# EAGLE design project_02 (EAGLE 9.6.2)
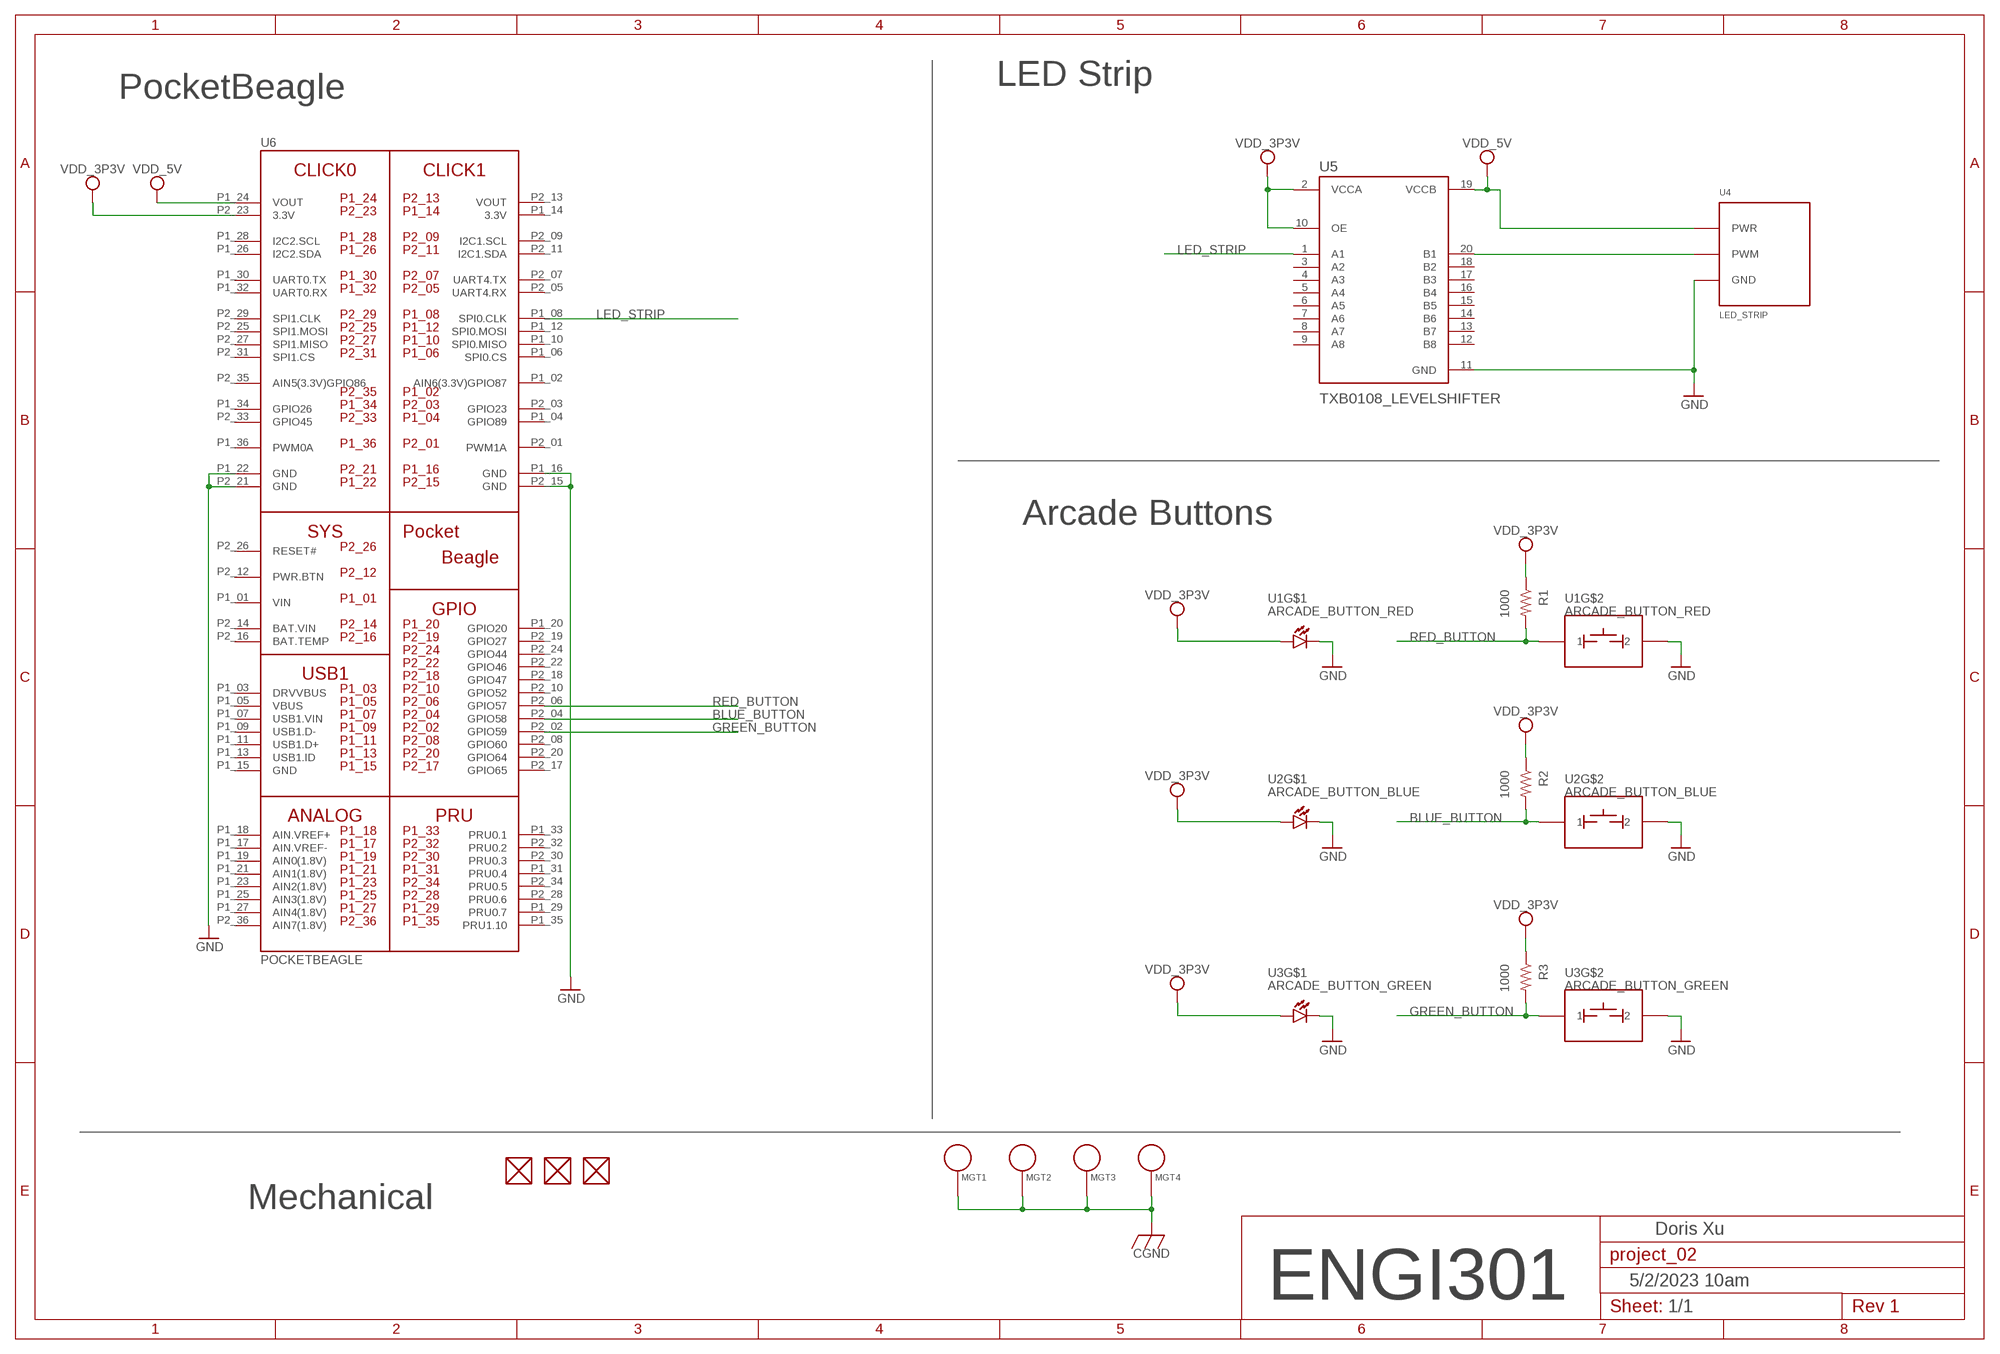
[diagram p0: schematic, sheet 1]

## Parts
FUD1  FIDUCIAL  [FIDUCIAL_40MIL]
FUD2  FIDUCIAL  [FIDUCIAL_40MIL]
FUD3  FIDUCIAL  [FIDUCIAL_40MIL]
MGT1  MOUNTING_HOLE  [MOUNTING_HOLE]
MGT2  MOUNTING_HOLE  [MOUNTING_HOLE]
MGT3  MOUNTING_HOLE  [MOUNTING_HOLE]
MGT4  MOUNTING_HOLE  [MOUNTING_HOLE]
R1  1000  R_R1206  [R1206]
R2  1000  R_R1206  [R1206]
R3  1000  R_R1206  [R1206]
U1  ARCADE_BUTTON_RED  ARCADE_BUTTON  [LED_BUTTON]
U2  ARCADE_BUTTON_BLUE  ARCADE_BUTTON  [LED_BUTTON]
U3  ARCADE_BUTTON_GREEN  ARCADE_BUTTON  [LED_BUTTON]
U4  LED_STRIP  [LED_STRIP]
U5  TXB0108_LEVELSHIFTER  [SOP65P640X120-20N]
U6  POCKETBEAGLE  [POCKETBEAGLE]

## Nets
BLUE_BUTTON: R2.2 U2.BUTTON_1 U6.P2_04(GPIO58)
CGND: MGT1.P$1 MGT2.P$1 MGT3.P$1 MGT4.P$1
GND: U1.BUTTON_2 U1.CATHODE U2.BUTTON_2 U2.CATHODE U3.BUTTON_2 U3.CATHODE U4.GND U5.11(GND) U6.P1_16(GND) U6.P1_22(GND) U6.P2_15(GND) U6.P2_21(GND)
GREEN_BUTTON: R3.2 U3.BUTTON_1 U6.P2_02(GPIO59)
LED_SIGNAL: U4.SIG(PWM) U5.20(B1)
LED_STRIP: U5.1(A1) U6.P1_08(SPI0.CLK)
RED_BUTTON: R1.2 U1.BUTTON_1 U6.P2_06(GPIO57)
VDD_3P3V: R1.1 R2.1 R3.1 U1.ANODE U2.ANODE U3.ANODE U5.2(VCCA) U5.10(OE) U6.P2_23(3.3V)
VDD_5V: U4.PWR U5.19(VCCB) U6.P1_24(VOUT)
Unconnected: FUD1.P$1 FUD2.P$1 FUD3.P$1 U5.3(A2) U5.4(A3) U5.5(A4) U5.6(A5) U5.7(A6) U5.8(A7) U5.9(A8) U5.12(B8) U5.13(B7) U5.14(B6) U5.15(B5) U5.16(B4) U5.17(B3) U5.18(B2) U6.P1_02(AIN6(3.3V)GPIO87) U6.P1_03(DRVVBUS) U6.P1_04(GPIO89) U6.P1_05(VBUS) U6.P1_06(SPI0.CS) U6.P1_07(USB1.VIN) U6.P1_09(USB1.D-) U6.P1_10(SPI0.MISO) U6.P1_11(USB1.D+) U6.P1_12(SPI0.MOSI) U6.P1_13(USB1.ID) U6.P1_15(GND) U6.P1_17(AIN.VREF-) U6.P1_18(AIN.VREF+) U6.P1_19(AIN0(1.8V)) U6.P1_20(GPIO20) U6.P1_21(AIN1(1.8V)) U6.P1_23(AIN2(1.8V)) U6.P1_25(AIN3(1.8V)) U6.P1_26(I2C2.SDA) U6.P1_27(AIN4(1.8V)) U6.P1_28(I2C2.SCL) U6.P1_29(PRU0.7) U6.P1_30(UART0.TX) U6.P1_31(PRU0.4) U6.P1_32(UART0.RX) U6.P1_33(PRU0.1) U6.P1_34(GPIO26) U6.P1_35(PRU1.10) U6.P1_36(PWM0A) U6.P2_01(PWM1A) U6.P2_03(GPIO23) U6.P2_05(UART4.RX) U6.P2_07(UART4.TX) U6.P2_08(GPIO60) U6.P2_09(I2C1.SCL) U6.P2_10(GPIO52) U6.P2_11(I2C1.SDA) U6.P2_12(PWR.BTN) U6.P2_16(BAT.TEMP) U6.P2_17(GPIO65) U6.P2_18(GPIO47) U6.P2_19(GPIO27) U6.P2_20(GPIO64) U6.P2_22(GPIO46) U6.P2_24(GPIO44) U6.P2_25(SPI1.MOSI) U6.P2_26(RESET#) U6.P2_27(SPI1.MISO) U6.P2_28(PRU0.6) U6.P2_29(SPI1.CLK) U6.P2_30(PRU0.3) U6.P2_31(SPI1.CS) U6.P2_32(PRU0.2) U6.P2_33(GPIO45) U6.P2_34(PRU0.5) U6.P2_35(AIN5(3.3V)GPIO86) U6.P2_36(AIN7(1.8V))

## Notes on the sheet
- LED Strip
- PocketBeagle
- Arcade Buttons
- Mechanical
- Doris Xu
- 5/2/2023 10am
- ENGI301
- 1/1

## Power pins joined to a net without a drawn wire
3.3V: U6.P1_14(3.3V)
BAT.VIN: U6.P2_14(BAT.VIN)
VIN: U6.P1_01(VIN)
VOUT: U6.P2_13(VOUT)

## Library data of the parts
FUD1-FUD3 = project_02:FIDUCIAL
MGT1-MGT4 = project_02:MOUNTING_HOLE: Chassis Mounting Hole w/GND connection ability
R1-R3 = project_02:R_: RESISTOR, American symbol
U1-U3 = project_02:ARCADE_BUTTON
U4 = project_02:LED_STRIP
U5 = project_02:TXB0108_LEVELSHIFTER: 8-Bit Bidirectional Voltage-Level Shifter with Auto Direction Sensing and +/-15-kV ESD Protect 20-TSSOP -40 to 85 Check availability <https://pricing.snapeda.com/parts/TXB0108PWRG4/Texas%20Instruments/view-part?ref=eda>; AVAILABILITY: In Stock; DESCRIPTION: 8-Bit Bidirectional Voltage-Level Shifter with Auto Direction Sensing and +/-15-kV ESD Protect 20-TSSOP -40 to 85; MF: Texas Instruments; MP: TXB0108PWRG4; PACKAGE: TSSOP-20 Texas Instruments; PRICE: None; PURCHASE-URL: https://pricing.snapeda.com/search/part/TXB0108PWRG4/?ref=eda
U6 = project_02:POCKETBEAGLE

## Board
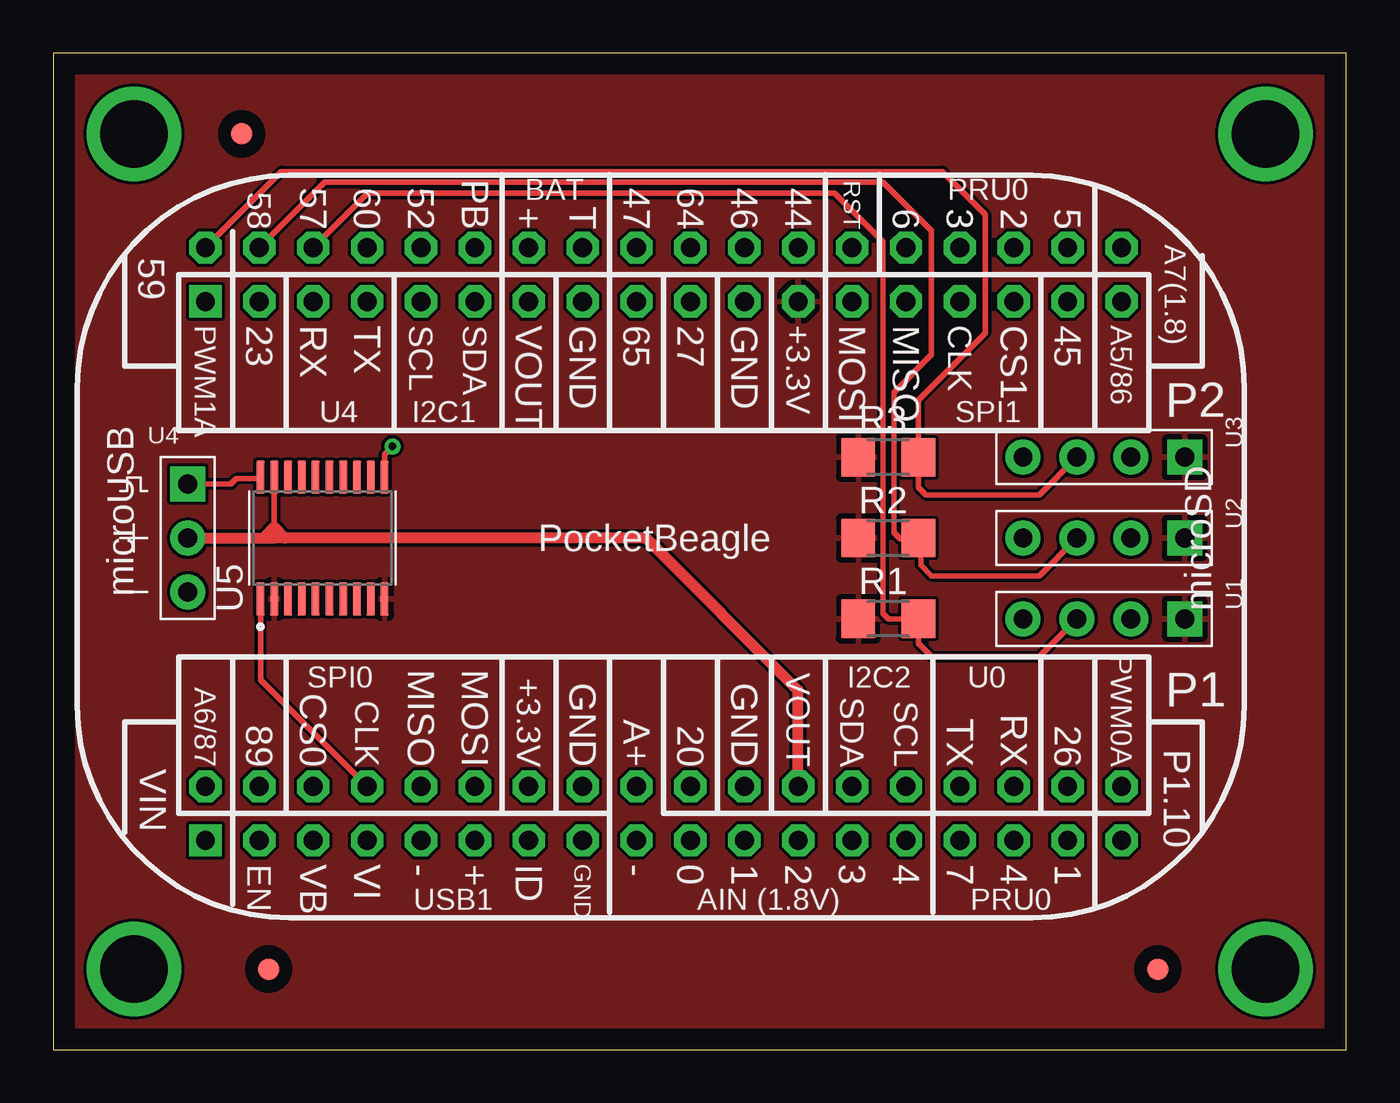
[diagram p1: board, top side]
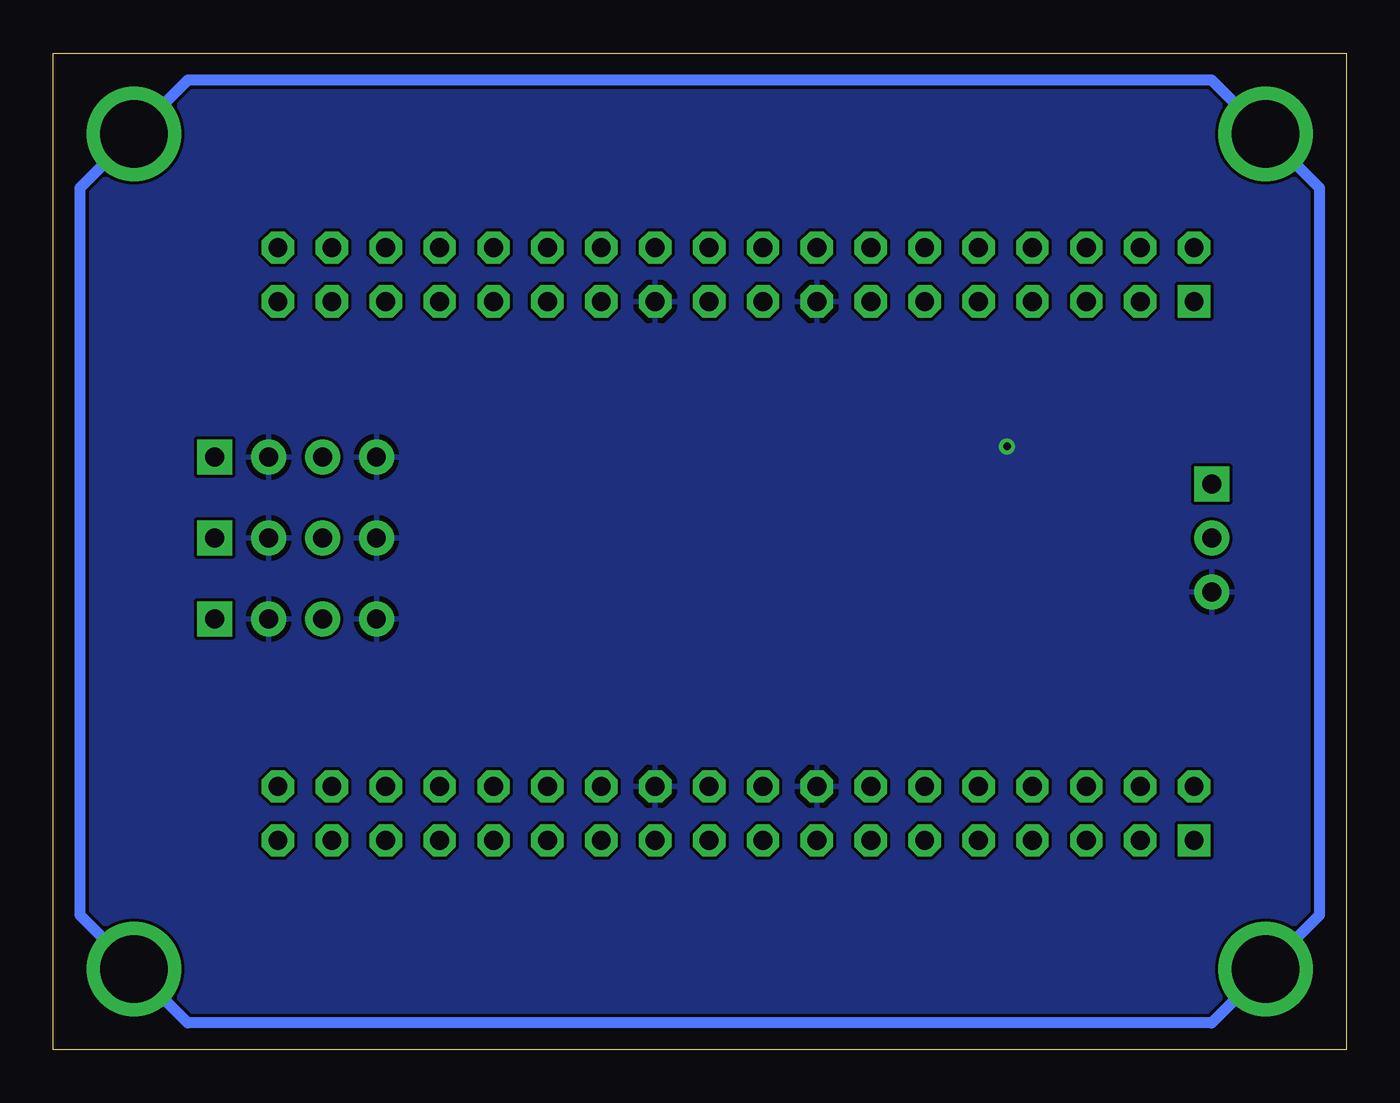
[diagram p2: board, bottom side, seen from below]

Size 60.96 x 46.99 mm. Coordinates in mm from the lower left corner, seen from the top.
Outline: 0,0 60.96,0 60.96,46.99 0,46.99 0,0
Copper layers (1*16): Top 0.035mm / dielectric 1.5mm / Bottom 0.035mm
Design rules "default": minimum track width 6mil, minimum drill 0.35mm, track to track 6mil, track to pad 6mil, pad to pad 6mil, via to via 6mil, smd to smd 6mil, copper to edge 40mil, drill to drill 6mil, minimum pad ring 10mil, minimum via ring 8mil, stop-mask expansion 4mil, vias tented up to drill 0mil, thermal gap 10mil

### Footprints (pad centres in the part's own frame; a part is rotated, then mirrored left to right if it is on the bottom)
FIDUCIAL_40MIL = smd 1.016 x 1.016: P$1 0,0
MOUNTING_HOLE = drill 3.175 pad 4.445: P$1 0,0
R1206 = smd 1.6 x 1.803: 1 -1.422,0; 2 1.422,0
LED_BUTTON = drill 0.889 pad 1.651 square: ANODE 0,3.81 | drill 0.889 pad 1.651: BUTTON_1 0,-1.27; BUTTON_2 0,-3.81; CATHODE 0,1.27
LED_STRIP = drill 0.889 pad 1.651: GND 0,-2.54; PWR 0,0 | drill 0.889 pad 1.651 square: SIG 0,2.54
SOP65P640X120-20N = smd 1.57 x 0.41: 1 -2.87,2.925; 2 -2.87,2.275; 3 -2.87,1.625; 4 -2.87,0.975; 5 -2.87,0.325; 6 -2.87,-0.325; 7 -2.87,-0.975; 8 -2.87,-1.625; 9 -2.87,-2.275; 10 -2.87,-2.925; 11 2.87,-2.925; 12 2.87,-2.275; 13 2.87,-1.625; 14 2.87,-0.975; 15 2.87,-0.325; 16 2.87,0.325; 17 2.87,0.975; 18 2.87,1.625; 19 2.87,2.275; 20 2.87,2.925
POCKETBEAGLE = drill 0.889 pad 1.524 square: P1_01 5.91,3.53; P2_01 5.91,28.93 | drill 0.889 pad 1.524 octagon: P1_02 5.91,6.07; P1_03 8.45,3.53; P1_04 8.45,6.07; P1_05 10.99,3.53; P1_06 10.99,6.07; P1_07 13.53,3.53; P1_08 13.53,6.07; P1_09 16.07,3.53; P1_10 16.07,6.07; P1_11 18.61,3.53; P1_12 18.61,6.07; P1_13 21.15,3.53; P1_14 21.15,6.07; P1_15 23.69,3.53; P1_16 23.69,6.07; P1_17 26.23,3.53; P1_18 26.23,6.07; P1_19 28.77,3.53; P1_20 28.77,6.07; P1_21 31.31,3.53; P1_22 31.31,6.07; P1_23 33.85,3.53; P1_24 33.85,6.07; P1_25 36.39,3.53; P1_26 36.39,6.07; P1_27 38.93,3.53; P1_28 38.93,6.07; P1_29 41.47,3.53; P1_30 41.47,6.07; P1_31 44.01,3.53; P1_32 44.01,6.07; P1_33 46.55,3.53; P1_34 46.55,6.07; P1_35 49.09,3.53; P1_36 49.09,6.07; P2_02 5.91,31.47; P2_03 8.45,28.93; P2_04 8.45,31.47; P2_05 10.99,28.93; P2_06 10.99,31.47; P2_07 13.53,28.93; P2_08 13.53,31.47; P2_09 16.07,28.93; P2_10 16.07,31.47; P2_11 18.61,28.93; P2_12 18.61,31.47; P2_13 21.15,28.93; P2_14 21.15,31.47; P2_15 23.69,28.93; P2_16 23.69,31.47; P2_17 26.23,28.93; P2_18 26.23,31.47; P2_19 28.77,28.93; P2_20 28.77,31.47; P2_21 31.31,28.93; P2_22 31.31,31.47; P2_23 33.85,28.93; P2_24 33.85,31.47; P2_25 36.39,28.93; P2_26 36.39,31.47; P2_27 38.93,28.93; P2_28 38.93,31.47; P2_29 41.47,28.93; P2_30 41.47,31.47; P2_31 44.01,28.93; P2_32 44.01,31.47; P2_33 46.55,28.93; P2_34 46.55,31.47; P2_35 49.09,28.93; P2_36 49.09,31.47

### Placement (x,y rotation side)
FUD1  52.07,3.81 0 top
FUD2  8.89,43.18 0 top
FUD3  10.16,3.81 0 top
MGT1  3.81,43.18 0 top
MGT2  57.15,43.18 0 top
MGT3  57.15,3.81 0 top
MGT4  3.81,3.81 0 top
R1  39.37,20.32 0 top
R2  39.37,24.13 0 top
R3  39.37,27.94 0 top
U1  49.53,20.32 270 top
U2  49.53,24.13 270 top
U3  49.53,27.94 270 top
U4  6.35,24.13 0 top
U5  12.7,24.13 90 top
U6  1.27,6.35 0 top

### Tracks (layer width: path | path; a pad name or v marks a point on that pad's centre or on a via)
BLUE_BUTTON
  Top 0.254: R2.2 40.84,24.08 | 40.84,24.08 40.89,24.03 40.89,22.86 41.4,22.35 46.48,22.35 U2.BUTTON_1 | U6.P2_04 12.79,40.89 39.12,40.89 41.4,38.61 41.4,32.77 39.62,30.99 39.62,24.38 39.93,24.08 40.84,24.08
CGND
  Bottom 0.508: MGT1.P$1 6.35,45.72 54.61,45.72 MGT2.P$1 59.69,40.64 59.69,6.35 MGT3.P$1 54.61,1.27 6.35,1.27 MGT4.P$1 1.27,6.35 1.27,40.64 MGT1.P$1
GND  (via drill 0.35 pad 0.61)
  Top 0.254: U5.11 15.62,28.07 v16,28.45
  pour Bottom: -2.54,-2.54 -2.54,49.53 63.5,49.53 63.5,-2.54
GREEN_BUTTON
  Top 0.254: U3.BUTTON_1 46.48,26.16 41.15,26.16 40.79,26.52 R3.2 40.79,30.63 43.94,33.78 43.94,39.37 41.91,41.4 10.76,41.4 U6.P2_02
LED_SIGNAL
  Top 0.254: U5.20 9.7,26.92 8.64,26.92 8.38,26.67 U4.SIG
LED_STRIP
  Top 0.254: U6.P1_08 9.78,17.45 U5.1
RED_BUTTON
  Top 0.254: U1.BUTTON_1 46.48,18.54 41.4,18.54 40.79,19.15 R1.2 39.37,20.32 39.12,20.57 39.12,38.1 36.83,40.39 14.83,40.39 U6.P2_06
VDD_3P3V
  pour Top: -5.08,-5.08 -5.08,52.07 66.04,52.07 66.04,-5.08
VDD_5V
  Top 0.254: U5.19 10.43,24.64 10.43,24.14 10.41,24.13
  Top 0.508: U6.P1_24 35.12,16.95 27.94,24.13 10.92,24.13 | 10.92,24.13 10.41,24.13 9.92,24.13 | U4.PWR 9.92,24.13 | 9.92,24.13 10.43,24.64 10.92,24.14 10.92,24.13